# EAGLE design Sensor Board v1.1 (EAGLE 6.5.0)
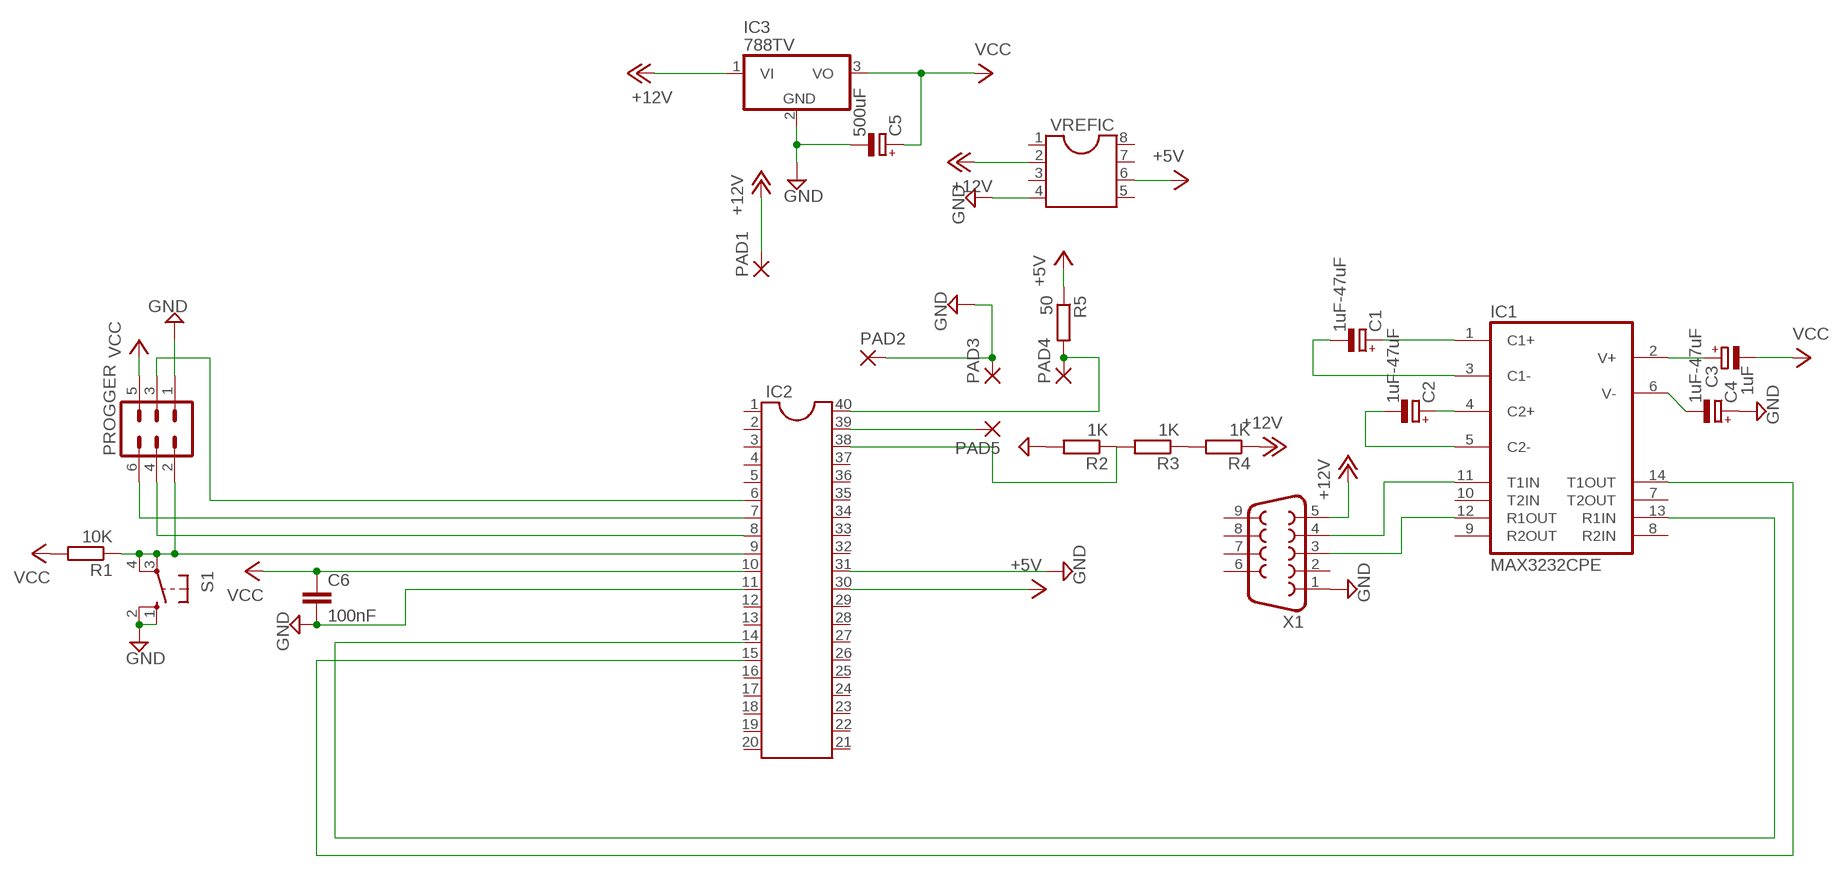
[diagram p0: schematic, sheet 1]

## Parts
C1  1uF-47uF  CPOL-EUTT5D7  [TT5D7]
C2  1uF-47uF  CPOL-EUE2-4  [E2-4]
C3  1uF  CPOL-EUTT5D7  [TT5D7]
C4  1uF-47uF  CPOL-EUE2-4  [E2-4]
C5  500uF  CPOL-EUE2-4  [E2-4]
C6  100nF  C-EU025-030X050  [C025-030X050]
IC1  MAX3232CPE  [DIL16]
IC2  DIL40  [DIL40]
IC3  788TV  [TO220V]
PAD1  3,81/1,3  [3,81/1,3]
PAD2  3,81/1,3  [3,81/1,3]
PAD3  3,81/1,3  [3,81/1,3]
PAD4  3,81/1,3  [3,81/1,3]
PAD5  3,81/1,3  [3,81/1,3]
PROGGER  MA03-2  [MA03-2]
R1  10K  R-EU_0204/5  [0204/5]
R2  1K  R-EU_0204/7  [0204/7]
R3  1K  R-EU_0204/7  [0204/7]
R4  1K  R-EU_0204/7  [0204/7]
R5  50  R-EU_0204/5  [0204/5]
S1  10-XX  [B3F-10XX]
VREFIC  DIL8  [DIL08]
X1  F09H  [F09H]

## Nets
+5V: IC2.30 R5.1 VREFIC.6
+12V: IC3.1(VI) PAD1.1(P) R4.1 VREFIC.2 X1.5
GND: C4.+ C5.- C6.2 IC2.11 IC2.31 IC3.2(GND) PAD2.1(P) PAD3.1(P) PROGGER.1 R2.2 S1.1(S) S1.2(S1) VREFIC.4 X1.1
N$1: IC2.7 PROGGER.6
N$2: IC2.8 PROGGER.4
N$3: IC2.9 PROGGER.2 R1.1 S1.3(P) S1.4(P1)
N$4: IC2.6 PROGGER.3
N$5: C1.+ IC1.1(C1+)
N$6: C1.- IC1.3(C1-)
N$7: C2.+ IC1.4(C2+)
N$8: C2.- IC1.5(C2-)
N$9: C3.+ IC1.2(V+)
N$10: C4.- IC1.6(V-)
N$11: IC1.14(T1OUT) IC2.15
N$12: IC1.13(R1IN) IC2.14
N$13: IC1.11(T1IN) X1.4
N$14: IC1.12(R1OUT) X1.3
N$15: IC2.40 PAD4.1(P) R5.2
N$16: IC2.39 PAD5.1(P)
N$17: IC2.38 R2.1 R3.2
N$18: R3.1 R4.2
VCC: C3.- C5.+ C6.1 IC2.10 IC3.3(VO) PROGGER.5 R1.2
Unconnected: IC1.7(T2OUT) IC1.8(R2IN) IC1.9(R2OUT) IC1.10(T2IN) IC2.1 IC2.2 IC2.3 IC2.4 IC2.5 IC2.12 IC2.13 IC2.16 IC2.17 IC2.18 IC2.19 IC2.20 IC2.21 IC2.22 IC2.23 IC2.24 IC2.25 IC2.26 IC2.27 IC2.28 IC2.29 IC2.32 IC2.33 IC2.34 IC2.35 IC2.36 IC2.37 VREFIC.1 VREFIC.3 VREFIC.5 VREFIC.7 VREFIC.8 X1.2 X1.6 X1.7 X1.8 X1.9

## Power pins joined to a net without a drawn wire
GND: IC1.15(GND)
VCC: IC1.16(VCC)

## Library data of the parts
C1-C5 = rcl:CPOL-EU: POLARIZED CAPACITOR, European symbol
C6 = rcl:C-EU: CAPACITOR, European symbol
IC1 = maxim:MAX3232*: True RS-232 Transceivers 3.0V to 5.5V, Low-Power up to 1Mbps, Using Four 0.1µF External Capacitors Source: http://pdfserv.maxim-ic.com/en/ds/MAX3222-MAX3241.pdf; MF: MAXIM; MPN: MAX3232CPE+; OC_FARNELL: 9724494; OC_NEWARK: 68K4626
IC2 = ic-package:DIL40: Dual In Line
IC3 = linear:78*: Positive VOLTAGE REGULATOR Source: http://cache.national.com/ds/LM/LM78L05.pdf http://www.fairchildsemi.com/ds/LM/LM7805.pdf
PAD1-PAD5 = wirepad:3,81/1,3: THROUGH-HOLE PAD
PROGGER = con-lstb:MA03-2: PIN HEADER; OC_FARNELL: unknown; OC_NEWARK: unknown
R1-R5 = resistor:R-EU_: RESISTOR, European symbol
S1 = switch-omron:10-XX: OMRON SWITCH; MPN: B3F-1000; OC_FARNELL: 176432; OC_NEWARK: 36M3542
VREFIC = ic-package:DIL8: Dual In Line / Socket
X1 = con-subd:F09: SUB-D; OC_FARNELL: unknown; OC_NEWARK: unknown

## Board
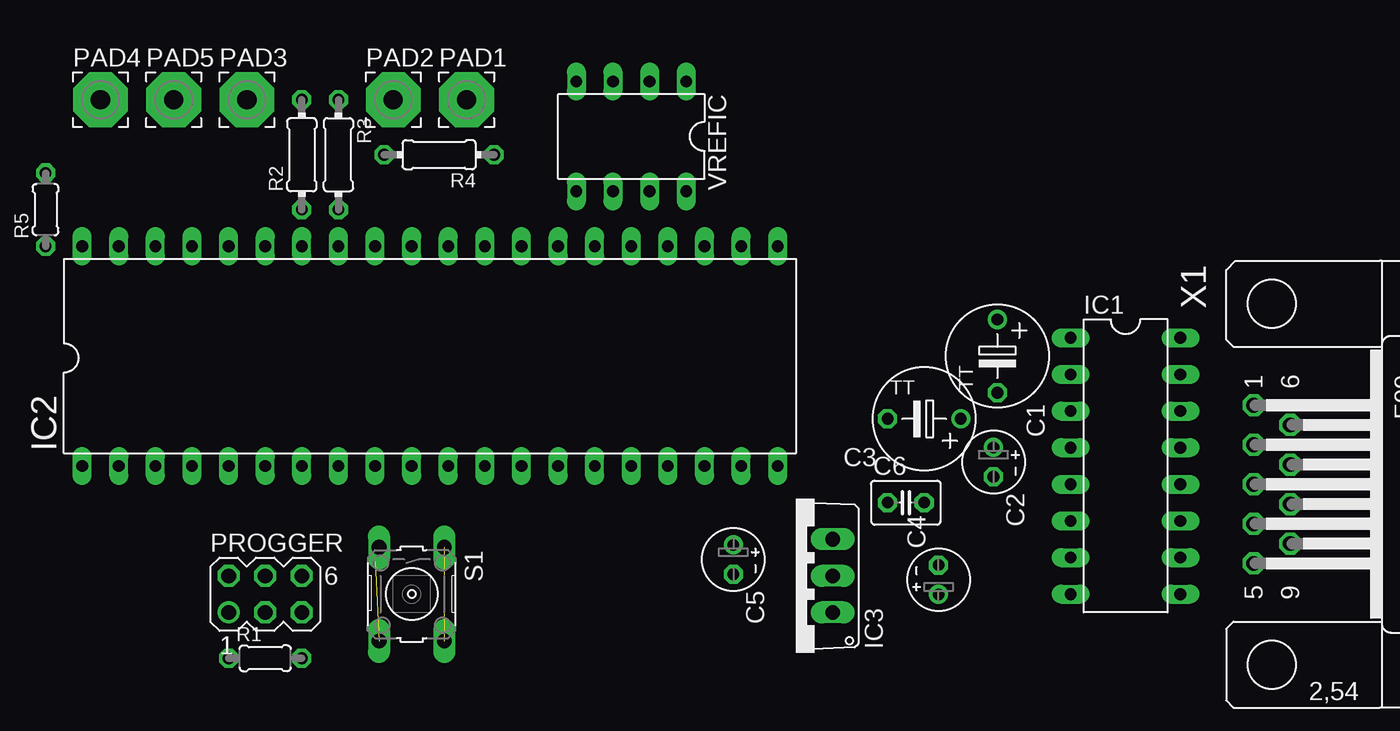
[diagram p1: board, top side]
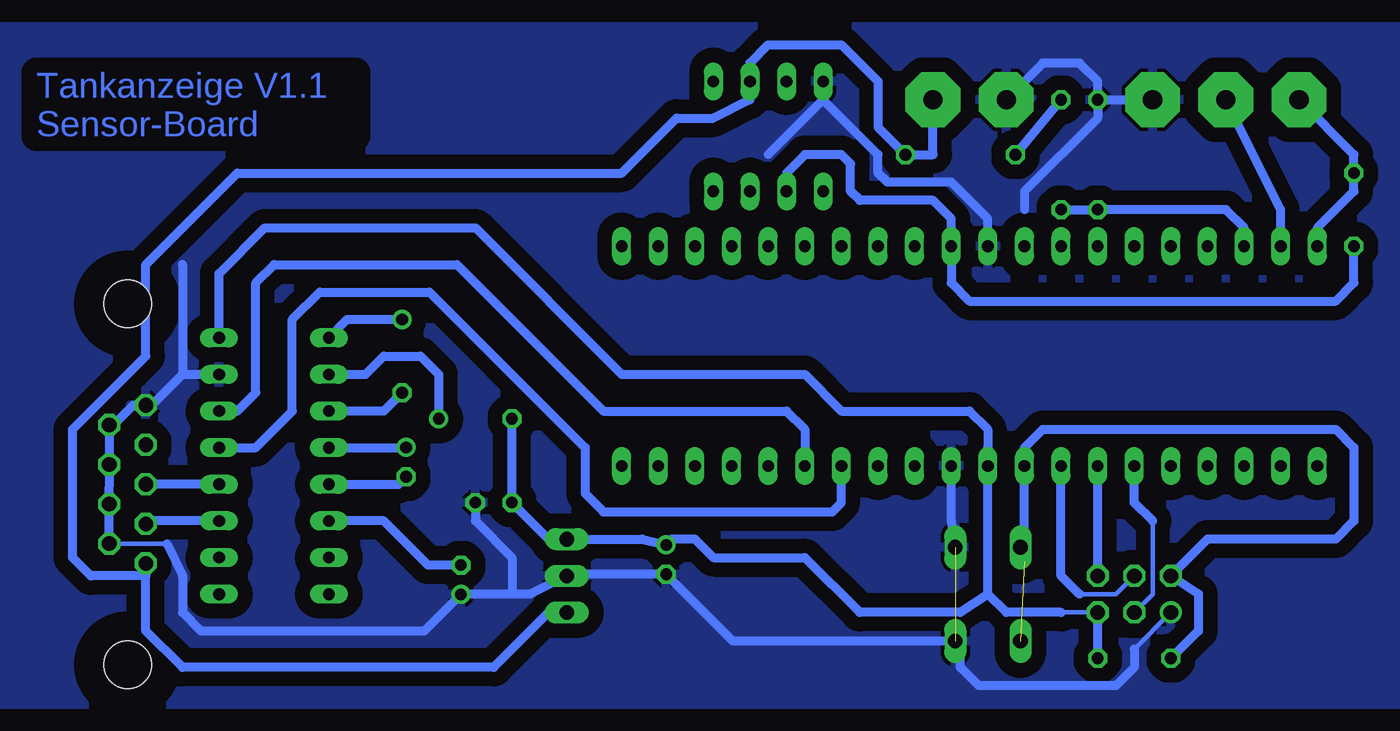
[diagram p2: board, bottom side, seen from below]

No outline drawn. Coordinates in mm, seen from the top.
Copper layers (1*16): Top 0.035mm / dielectric 1.5mm / Bottom 0.035mm
Design rules "default": minimum track width 10mil, minimum drill 24mil, track to track 8mil, track to pad 8mil, pad to pad 8mil, via to via 8mil, smd to smd 8mil, copper to edge 40mil, drill to drill 8mil, minimum pad ring 10mil, minimum via ring 8mil, stop-mask expansion 4mil, vias tented up to drill 0mil, thermal gap 10mil

### Footprints (pad centres in the part's own frame; a part is rotated, then mirrored left to right if it is on the bottom)
TT5D7 = drill 0.813: + -2.54,0 | drill 0.813 octagon: - 2.54,0
E2-4 = drill 0.813 pad 1.27: + -1.016,0 | drill 0.813 pad 1.27 octagon: - 1.016,0
C025-030X050 = drill 0.813 octagon: 1 -1.27,0; 2 1.27,0
DIL16 = drill 0.813 long: 1 -8.89,-3.81; 2 -6.35,-3.81; 3 -3.81,-3.81; 4 -1.27,-3.81; 5 1.27,-3.81; 6 3.81,-3.81; 7 6.35,-3.81; 8 8.89,-3.81; 9 8.89,3.81; 10 6.35,3.81; 11 3.81,3.81; 12 1.27,3.81; 13 -1.27,3.81; 14 -3.81,3.81; 15 -6.35,3.81; 16 -8.89,3.81
DIL40 = drill 0.813 long: 1 -24.13,-7.62; 2 -21.59,-7.62; 3 -19.05,-7.62; 4 -16.51,-7.62; 5 -13.97,-7.62; 6 -11.43,-7.62; 7 -8.89,-7.62; 8 -6.35,-7.62; 9 -3.81,-7.62; 10 -1.27,-7.62; 11 1.27,-7.62; 12 3.81,-7.62; 13 6.35,-7.62; 14 8.89,-7.62; 15 11.43,-7.62; 16 13.97,-7.62; 17 16.51,-7.62; 18 19.05,-7.62; 19 21.59,-7.62; 20 24.13,-7.62; 21 24.13,7.62; 22 21.59,7.62; 23 19.05,7.62; 24 16.51,7.62; 25 13.97,7.62; 26 11.43,7.62; 27 8.89,7.62; 28 6.35,7.62; 29 3.81,7.62; 30 1.27,7.62; 31 -1.27,7.62; 32 -3.81,7.62; 33 -6.35,7.62; 34 -8.89,7.62; 35 -11.43,7.62; 36 -13.97,7.62; 37 -16.51,7.62; 38 -19.05,7.62; 39 -21.59,7.62; 40 -24.13,7.62
TO220V = drill 1.016 long: 1 -2.54,-2.54; 2 0,-2.54; 3 2.54,-2.54
3,81/1,3 = drill 1.321 pad 3.81 octagon: 1 0,0
MA03-2 = drill 1.016: 1 -2.54,-1.27 | drill 1.016 octagon: 2 -2.54,1.27; 3 0,-1.27; 4 0,1.27; 5 2.54,-1.27; 6 2.54,1.27
0204/5 = drill 0.813 octagon: 1 -2.54,0; 2 2.54,0
0204/7 = drill 0.813 octagon: 1 -3.81,0; 2 3.81,0
B3F-10XX = drill 1.016 long: 1 -3.251,2.261; 2 3.251,2.261; 3 -3.251,-2.261; 4 3.251,-2.261
DIL08 = drill 0.813 long: 1 -3.81,-3.81; 2 -1.27,-3.81; 3 1.27,-3.81; 4 3.81,-3.81; 5 3.81,3.81; 6 1.27,3.81; 7 -1.27,3.81; 8 -3.81,3.81
F09H = drill 1.016 octagon: 1 -5.486,-1.27; 2 -2.743,-1.27; 3 0,-1.27; 4 2.743,-1.27; 5 5.486,-1.27; 6 -4.115,1.27; 7 -1.372,1.27; 8 1.372,1.27; 9 4.115,1.27 | hole 3.302: -12.522,0; 12.522,0

### Placement (x,y rotation side)
C1  77.47,24.13 270 top
C2  77.2,16.78 270 top
C3  72.39,19.78 180 top
C4  73.39,8.62 90 top
C5  59.15,10.02 270 top
C6  71.12,13.97 0 top
IC1  86.36,16.51 270 top
IC2  38.1,24.13 0 top
IC3  63.5,8.89 90 top
PAD1  40.64,41.91 0 top
PAD2  35.56,41.91 0 top
PAD3  25.4,41.91 0 top
PAD4  15.24,41.91 0 top
PAD5  20.32,41.91 0 top
PROGGER  26.67,7.62 0 top
R1  26.67,3.17 0 top
R2  29.21,38.1 90 top
R3  31.75,38.1 270 top
R4  38.73,38.1 180 top
R5  11.43,34.29 90 top
S1  36.83,7.62 270 top
VREFIC  52.07,39.37 180 top
X1  96.52,15.24 270 top

### Tracks (layer width: path | path; a pad name or v marks a point on that pad's centre or on a via)
+5V
  Bottom 0.61: VREFIC.6 50.8,36.83 49.53,38.1 46.99,38.1 46.35,37.47 46.35,35.56 45.72,34.92 40.64,34.92 39.37,33.66 IC2.30 39.37,29.21 38.1,27.94 12.7,27.94 11.43,29.21 R5.1
+12V
  Bottom 0.61: IC3.1 67.31,6.35 71.12,2.54 92.71,2.54 95.25,5.08 95.25,8.89 | X1.5 95.25,8.89 | 95.25,8.89 99.06,8.89 100.33,10.16 100.33,19.05 95.25,24.13 95.25,30.48 88.9,36.83 62.23,36.83 58.42,40.64 55.88,40.64 53.34,41.91 VREFIC.2 53.34,44.45 52.07,45.72 46.99,45.72 44.45,43.18 44.45,40.01 R4.1 40.64,38.1 PAD1.1
GND  (1 unrouted)
  Bottom 0.305: 97.81,11.1 93.78,11.1 | PROGGER.1 26.67,3.81
  Bottom 0.61: IC3.2 68.58,7.62 69.85,7.62 | 69.85,7.62 C4.+ 75.91,5.08 91.44,5.08 92.71,6.35 92.71,8.89 93.78,11.1 | 67.31,8.89 IC3.2 | 97.81,11.1 97.79,19.05 96.11,20.73 X1.1 94.84,20.73 92.71,22.86 | 92.71,22.86 IC1.15 | IC3.2 65.93,9 C5.- 54.52,4.37 S1.2 38.73,4.01 38.73,2.54 37.47,1.27 27.94,1.27 26.67,2.54 26.67,3.81 | C6.2 72.39,12.7 69.85,10.16 69.85,7.62 | 69.85,7.62 | S1.1 39.09,11.07 39.37,12.7 IC2.11 | R2.2 29.21,40.64 34.29,35.56 34.29,34.29 | IC2.31 36.83,33.66 39.37,36.2 43.81,36.2 44.45,36.83 44.45,38.1 48.26,41.91 | 48.26,41.91 52.07,38.1 | 92.71,30.48 92.71,22.86 | 48.26,41.91 VREFIC.4 | R2.2 29.21,43.18 30.48,44.45 33.02,44.45 PAD2.1 | R2.2 PAD3.1
  pour Bottom (isolate 1.016): 105.41,0 7.62,0 7.62,46.99 105.41,46.99
N$1
  Bottom 0.61: PROGGER.6 IC2.7
N$2
  Bottom 0.305: PROGGER.4 27.94,7.62 30.48,7.62
  Bottom 0.61: 30.48,7.62 31.75,8.89 IC2.8
N$3  (1 unrouted)
  Bottom 0.61: R1.1 22.23,5.08 22.23,7.62 PROGGER.2 21.59,11.43 12.7,11.43 11.43,12.7 11.43,17.78 12.7,19.05 33.02,19.05 34.29,17.78 IC2.9 34.29,9.88 S1.3
N$4
  Bottom 0.305: PROGGER.3 25.4,7.62 25.4,12.7
  Bottom 0.61: 25.4,12.7 26.67,13.97 IC2.6
N$5
  Bottom 0.61: IC1.1 81.28,26.67 C1.+
N$6
  Bottom 0.61: C1.- 78.74,20.32 IC1.3
N$7
  Bottom 0.61: IC1.4 77.22,17.78 C2.+
N$8
  Bottom 0.61: IC1.5 77.72,15.24 C2.-
N$9
  Bottom 0.61: IC1.2 80.01,22.86 78.74,24.13 76.2,24.13 74.93,22.86 C3.+
N$10
  Bottom 0.61: C4.- 75.68,9.64 78.74,12.7 IC1.6
N$11
  Bottom 0.61: IC1.14 88.9,20.32 87.63,21.59 87.63,29.21 86.36,30.48 73.66,30.48 63.5,20.32 50.8,20.32 49.53,19.05 IC2.15
N$12
  Bottom 0.61: IC1.13 87.63,17.78 85.09,20.32 85.09,26.67 83.19,28.57 75.56,28.57 64.77,17.78 64.77,14.61 63.5,13.34 47.62,13.34 46.99,13.97 IC2.14
N$13
  Bottom 0.61: IC1.11 95.05,12.7 X1.4
N$14
  Bottom 0.61: IC1.12 X1.3
N$15
  Bottom 0.61: IC2.40 13.97,33.02 11.43,35.56 R5.2 11.43,38.1 PAD4.1
N$16
  Bottom 0.61: IC2.39 16.51,34.29 PAD5.1
N$17
  Bottom 0.61: R3.2 R2.1 20.32,34.29 19.05,33.02 IC2.38
N$18
  Bottom 0.61: R3.1 R4.2
VCC
  Bottom 0.305: PROGGER.5 31.75,6.35
  Bottom 0.61: C3.- C6.1 67.31,11.43 IC3.3 60.81,11.43 C5.+ 58.76,11.43 57.15,11.43 55.88,10.16 49.53,10.16 45.72,6.35 38.73,6.35 36.83,7.62 | 36.83,17.78 IC2.10 | R1.2 PROGGER.5 | 31.75,6.35 35.56,6.35 36.83,7.62 | 36.83,7.62 IC2.10 | IC1.16 90.17,29.84 87,33.02 72.39,33.02 62.23,22.86 49.53,22.86 46.99,20.32 38.1,20.32 36.83,19.05 IC2.10

### Text on the board
Bottom: Tankanzeige V1.1 / Sensor-Board